# Altium schematic sheet Power_supply.SchDoc
size A4; SheetNumber: 6; SheetTotal: 6
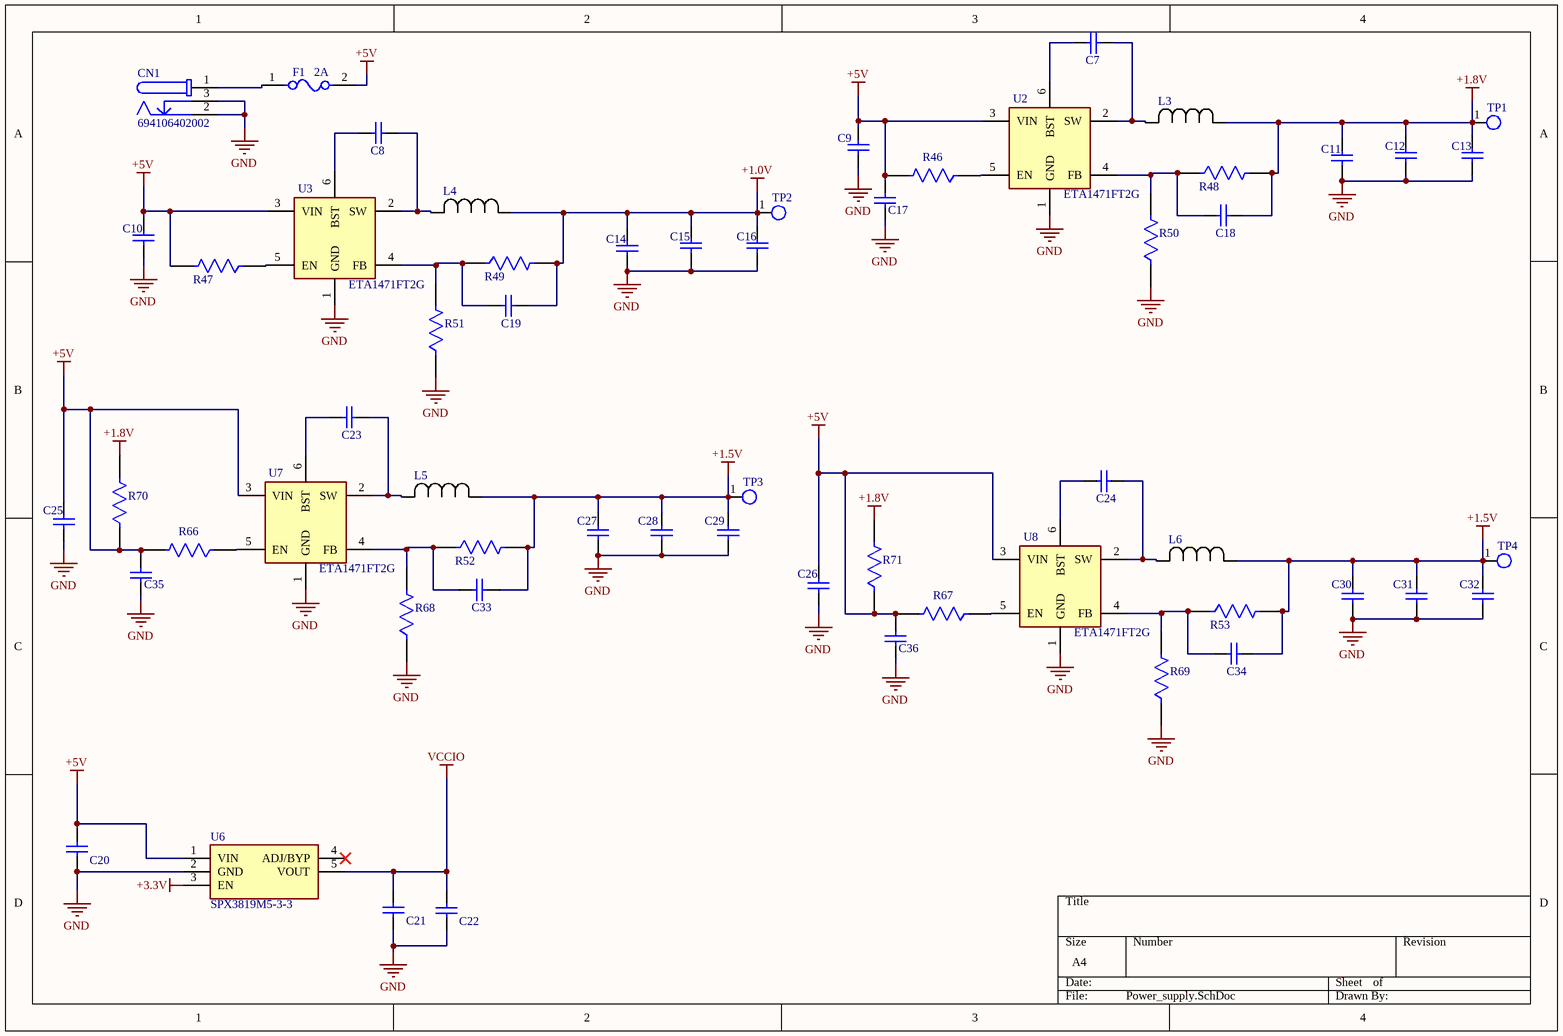
[diagram p0: Power_supply.SchDoc]

## Parts
C7  VJ0805Y152KXAAC  [CAPC2013X145X48NL20T23]  (value not drawn)
C8  VJ0805Y152KXAAC  [CAPC2013X145X48NL20T23]  (value not drawn)
C9  VJ0805Y152KXAAC  [CAPC2013X145X48NL20T23]  (value not drawn)
C10  VJ0805Y152KXAAC  [CAPC2013X145X48NL20T23]  (value not drawn)
C11  VJ0805Y152KXAAC  [CAPC2013X145X48NL20T23]  (value not drawn)
C12  VJ0805Y152KXAAC  [CAPC2013X145X48NL20T23]  (value not drawn)
C13  VJ0805Y152KXAAC  [CAPC2013X145X48NL20T23]  (value not drawn)
C14  VJ0805Y152KXAAC  [CAPC2013X145X48NL20T23]  (value not drawn)
C15  VJ0805Y152KXAAC  [CAPC2013X145X48NL20T23]  (value not drawn)
C16  VJ0805Y152KXAAC  [CAPC2013X145X48NL20T23]  (value not drawn)
C17  VJ0805Y152KXAAC  [CAPC2013X145X48NL20T23]  (value not drawn)
C18  VJ0805Y152KXAAC  [CAPC2013X145X48NL20T23]  (value not drawn)
C19  VJ0805Y152KXAAC  [CAPC2013X145X48NL20T23]  (value not drawn)
C20  VJ0805Y152KXAAC  [CAPC2013X145X48NL20T23]  (value not drawn)
C21  VJ0805Y152KXAAC  [CAPC2013X145X48NL20T23]  (value not drawn)
C22  VJ0805Y152KXAAC  [CAPC2013X145X48NL20T23]  (value not drawn)
C23  VJ0805Y152KXAAC  [CAPC2013X145X48NL20T23]  (value not drawn)
C24  VJ0805Y152KXAAC  [CAPC2013X145X48NL20T23]  (value not drawn)
C25  VJ0805Y152KXAAC  [CAPC2013X145X48NL20T23]  (value not drawn)
C26  VJ0805Y152KXAAC  [CAPC2013X145X48NL20T23]  (value not drawn)
C27  VJ0805Y152KXAAC  [CAPC2013X145X48NL20T23]  (value not drawn)
C28  VJ0805Y152KXAAC  [CAPC2013X145X48NL20T23]  (value not drawn)
C29  VJ0805Y152KXAAC  [CAPC2013X145X48NL20T23]  (value not drawn)
C30  VJ0805Y152KXAAC  [CAPC2013X145X48NL20T23]  (value not drawn)
C31  VJ0805Y152KXAAC  [CAPC2013X145X48NL20T23]  (value not drawn)
C32  VJ0805Y152KXAAC  [CAPC2013X145X48NL20T23]  (value not drawn)
C33  VJ0805Y152KXAAC  [CAPC2013X145X48NL20T23]  (value not drawn)
C34  VJ0805Y152KXAAC  [CAPC2013X145X48NL20T23]  (value not drawn)
C35  VJ0805Y152KXAAC  [CAPC2013X145X48NL20T23]  (value not drawn)
C36  VJ0805Y152KXAAC  [CAPC2013X145X48NL20T23]  (value not drawn)
CN1  694106402002  [694106402002]
F1  2A  [FP-0683G-MFG]
L3  ASPIAIG-FLR4020-3R3M-T  [IND_ASPIAIG-F4020_ABR]  (value not drawn)
L4  ASPIAIG-FLR4020-3R3M-T  [IND_ASPIAIG-F4020_ABR]  (value not drawn)
L5  ASPIAIG-FLR4020-3R3M-T  [IND_ASPIAIG-F4020_ABR]  (value not drawn)
L6  ASPIAIG-FLR4020-3R3M-T  [IND_ASPIAIG-F4020_ABR]  (value not drawn)
R46  MCU0805MD4991BP100  [FP-MCU0805-MFG]  (value not drawn)
R47  MCU0805MD4991BP100  [FP-MCU0805-MFG]  (value not drawn)
R48  MCU0805MD4991BP100  [FP-MCU0805-MFG]  (value not drawn)
R49  MCU0805MD4991BP100  [FP-MCU0805-MFG]  (value not drawn)
R50  MCU0805MD4991BP100  [FP-MCU0805-MFG]  (value not drawn)
R51  MCU0805MD4991BP100  [FP-MCU0805-MFG]  (value not drawn)
R52  MCU0805MD4991BP100  [FP-MCU0805-MFG]  (value not drawn)
R53  MCU0805MD4991BP100  [FP-MCU0805-MFG]  (value not drawn)
R66  MCU0805MD4991BP100  [FP-MCU0805-MFG]  (value not drawn)
R67  MCU0805MD4991BP100  [FP-MCU0805-MFG]  (value not drawn)
R68  MCU0805MD4991BP100  [FP-MCU0805-MFG]  (value not drawn)
R69  MCU0805MD4991BP100  [FP-MCU0805-MFG]  (value not drawn)
R70  MCU0805MD4991BP100  [FP-MCU0805-MFG]  (value not drawn)
R71  MCU0805MD4991BP100  [FP-MCU0805-MFG]  (value not drawn)
TP1  testpoint  (value not drawn)
TP2  testpoint  (value not drawn)
TP3  testpoint  (value not drawn)
TP4  testpoint  (value not drawn)
U2  ETA1471FT2G  [SOT95P280X110-6N]
U3  ETA1471FT2G  [SOT95P280X110-6N]
U6  SPX3819M5-3-3  [SOT95P280X145-5N]
U7  ETA1471FT2G  [SOT95P280X110-6N]
U8  ETA1471FT2G  [SOT95P280X110-6N]

## Nets
+1.0V: C14.2 C15.2 C16.2 C19.1 L4.1 R49.2 TP2.1
+1.5V: C27.2 C28.2 C29.2 C30.2 C31.2 C32.2 C33.1 C34.1 L5.1 L6.1 R52.2 R53.2 TP3.1 TP4.1
+1.8V: C11.2 C12.2 C13.2 C18.1 L3.1 R48.2 R70.2 R71.2 TP1.1
+3.3V: U6.3(EN)
+5V: C9.1 C10.1 C17.1 C20.1 C25.1 C26.1 C35.1 C36.1 F1.2 R46.2 R47.2 R66.2 R67.2 R70.1 R71.1 U2.3(VIN) U3.3(VIN) U6.1(VIN) U7.3(VIN) U8.3(VIN)
GND: C9.2 C10.2 C11.1 C12.1 C13.1 C14.1 C15.1 C16.1 C17.2 C20.2 C21.2 C22.2 C25.2 C26.2 C27.1 C28.1 C29.1 C30.1 C31.1 C32.1 C35.2 C36.2 CN1.2 CN1.3 R50.1 R51.1 R68.1 R69.1 U2.1(GND) U3.1(GND) U6.2(GND) U7.1(GND) U8.1(GND)
VCCIO: C21.1 C22.1 U6.5(VOUT)
NetC7_1: C7.1 L3.2 U2.2(SW)
NetC7_2: C7.2 U2.6(BST)
NetC8_1: C8.1 L4.2 U3.2(SW)
NetC8_2: C8.2 U3.6(BST)
NetC18_2: C18.2 R48.1 R50.2 U2.4(FB)
NetC19_2: C19.2 R49.1 R51.2 U3.4(FB)
NetC23_1: C23.1 L5.2 U7.2(SW)
NetC23_2: C23.2 U7.6(BST)
NetC24_1: C24.1 L6.2 U8.2(SW)
NetC24_2: C24.2 U8.6(BST)
NetC33_2: C33.2 R52.1 R68.2 U7.4(FB)
NetC34_2: C34.2 R53.1 R69.2 U8.4(FB)
NetCN1_1: CN1.1 F1.1
NetR46_1: R46.1 U2.5(EN)
NetR47_1: R47.1 U3.5(EN)
NetR66_1: R66.1 U7.5(EN)
NetR67_1: R67.1 U8.5(EN)

Not connected (* = marked no-connect by the designer): U6 4(ADJ/BYP)*

## Library data of the parts
C7-C36 = CMP-2007-01729-1: Manufacturer: Vitramon; Part Number: VJ0805Y152KXAAC
CN1 = CMP-1502-00189-3: DC Power Jack Connector WR-DC, Male, Vertical, THT, 3 A, 20 V; Voltage Rating: 30V; Shielding: Unshielded; Operating Supply Voltage: 20V; Current Rating: 3A; Number of Contacts: 1; Insulation Resistance: 100MΩ; Max Operating Temperature: 85°C; Height: 14.3mm; Orientation: Vertical; REACH SVHC: Unknown; RoHS: Compliant; Min Operating Temperature: -40°C; Termination: Through Hole; Contact Material: Gold; Flammability Rating: UL94 V-0; Voltage Rating (DC): 20V; Housing Material: Polyamide; Mount: Through Hole; Connector Type: Power; Contact Gender: Female; Color: Black; Gender: Male; Contact Plating: Tin; Packaging: Bulk
F1 = CMP-16042-000016-1: FUSE SLOW 125VDC 350VAC 2A
L3-L6 = ASPIAIG-FLR4020-3R3M-T: Description; Manufacturer_Name: Abracon; Copyright: Copyright (C) 2026 Ultra Librarian. All rights reserved.; Manufacturer_Part_Number: ASPIAIG-FLR4020-3R3M-T
R46-R53 R66-R71 = CMP-02407-000217-1: RES 1.05K OHM 0.5% 1/5W 0805; Resistance: 4.99kR; Power Rating: 200mW; Tolerance: 0.1%; Voltage Rating: 150V; Weight: 0.000194oz; Package Quantity: 1000; Height: 0.52mm; Case Code (Imperial): 0805; Width: 1.25mm; Packaging: Tape and Reel; Case/Package: 0805; Length: 2mm; Composition: Thin Film; Termination: SMD/SMT; Min Operating Temperature: -55°C; Case Code (Metric): 2012; Max Operating Temperature: 155°C
U2 U3 U7 U8 = ETA1471FT2G: Integrated Circuit; Manufacturer_Name: ETA Solutions; Datasheet Link: https://atlas.eefcdn.com/partdatasheet/700056/700056_26425269_1757294122249.pdf; Height: 1.1mm; Manufacturer_Part_Number: ETA1471FT2G
U6 = SPX3819M5-3-3: Integrated Circuit; Manufacturer_Name: EXAR; Datasheet Link: https://www.alldatasheet.com/datasheet-pdf/download/190079/SIPEX/SPX3819M5-3-3.html; Height: 1.45mm; Manufacturer_Part_Number: SPX3819M5-3-3; Mouser Part Number: N/A; Mouser Price/Stock: https://www.mouser.com/Search/Refine.aspx?Keyword=N%2FA